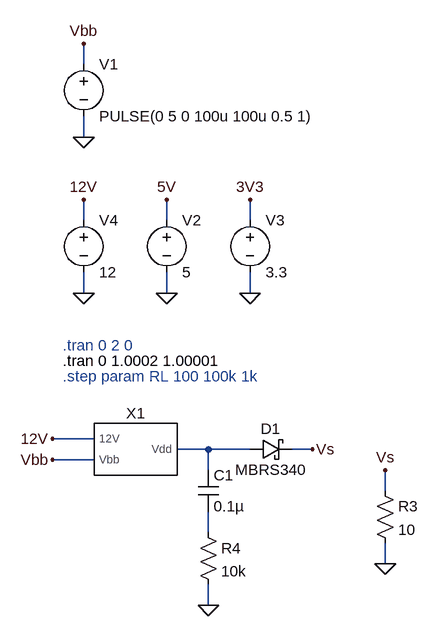
[diagram p0: schematic PDM-test-0.asc]
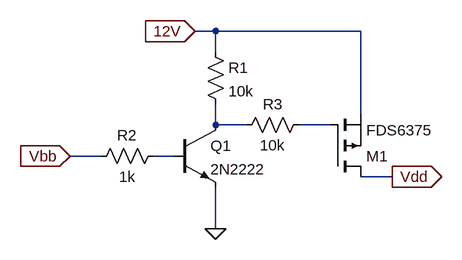
[diagram p1: sub-circuit pmos_5vl_12vp_hss.asc]
PDM-test-0.asc, the LTspice schematic file:
Version 4
SHEET 1 1652 1172
WIRE -48 96 -48 64
WIRE -48 208 -48 176
WIRE -48 336 -48 304
WIRE 80 336 80 304
WIRE 208 336 208 304
WIRE -48 448 -48 416
WIRE 80 448 80 416
WIRE 208 448 208 416
WIRE -32 672 -96 672
WIRE 144 688 96 688
WIRE 208 688 144 688
WIRE 304 688 272 688
WIRE -32 704 -96 704
WIRE 144 720 144 688
WIRE 416 752 416 720
WIRE 144 816 144 784
WIRE 416 864 416 832
WIRE 144 928 144 896
FLAG -48 208 0
FLAG -48 64 Vbb
FLAG 80 448 0
FLAG 80 304 5V
FLAG 208 448 0
FLAG 208 304 3V3
FLAG -48 448 0
FLAG -48 304 12V
FLAG 416 864 0
FLAG 144 928 0
FLAG -96 672 12V
FLAG -96 704 Vbb
FLAG 304 688 Vs
FLAG 416 720 Vs
SYMBOL voltage -48 80 R0
WINDOW 123 0 0 Left 0
WINDOW 39 0 0 Left 0
SYMATTR InstName V1
SYMATTR Value PULSE(0 5 0 100u 100u 0.5 1)
SYMBOL voltage 80 320 R0
WINDOW 123 0 0 Left 0
WINDOW 39 0 0 Left 0
SYMATTR InstName V2
SYMATTR Value 5
SYMBOL voltage 208 320 R0
WINDOW 123 0 0 Left 0
WINDOW 39 0 0 Left 0
SYMATTR InstName V3
SYMATTR Value 3.3
SYMBOL voltage -48 320 R0
WINDOW 123 0 0 Left 0
WINDOW 39 0 0 Left 0
SYMATTR InstName V4
SYMATTR Value 12
SYMBOL res 400 736 R0
SYMATTR InstName R3
SYMATTR Value 10
SYMBOL cap 128 720 R0
SYMATTR InstName C1
SYMATTR Value 0.1µ
SYMBOL PMOS_5VL_12VP_HSS 32 688 R0
SYMATTR InstName X1
SYMBOL schottky 208 704 R270
WINDOW 0 32 32 VTop 2
WINDOW 3 0 32 VBottom 2
SYMATTR InstName D1
SYMATTR Value MBRS340
SYMATTR Description Diode
SYMATTR Type diode
SYMBOL res 128 800 R0
SYMATTR InstName R4
SYMATTR Value 10k
TEXT -80 552 Left 2 !.tran 0 1.0002 1.00001
TEXT -80 576 Left 2 ;.step param RL 100 100k 1k
TEXT -80 528 Left 2 ;.tran 0 2 0

pmos_5vl_12vp_hss.asc, the sub-circuit schematic file:
Version 4
SHEET 1 1336 680
WIRE 960 -64 928 -64
WIRE 1184 -64 960 -64
WIRE 960 -32 960 -64
WIRE 1184 64 1184 -64
WIRE 960 80 960 48
WIRE 1008 80 960 80
WIRE 1136 80 1088 80
WIRE 784 128 736 128
WIRE 896 128 864 128
WIRE 1232 160 1184 160
WIRE 960 240 960 176
FLAG 960 240 0
FLAG 736 128 Vbb
IOPIN 736 128 In
FLAG 928 -64 12V
IOPIN 928 -64 In
FLAG 1232 160 Vdd
IOPIN 1232 160 Out
SYMBOL npn 896 80 R0
SYMATTR InstName Q1
SYMATTR Value 2N2222
SYMBOL res 944 -48 R0
SYMATTR InstName R1
SYMATTR Value 10k
SYMBOL res 880 112 R90
WINDOW 0 0 56 VBottom 2
WINDOW 3 32 56 VTop 2
SYMATTR InstName R2
SYMATTR Value 1k
SYMBOL pmos 1136 160 M180
SYMATTR InstName M1
SYMATTR Value FDS6375
SYMBOL res 1104 64 R90
WINDOW 0 0 56 VBottom 2
WINDOW 3 32 56 VTop 2
SYMATTR InstName R3
SYMATTR Value 10k

The netlist it stands for:
* PDM-test-0.asc
V1 Vbb 0 PULSE(0 5 0 100u 100u 0.5 1)
V2 5V 0 5
V3 3V3 0 3.3
V4 12V 0 12
R3 Vs 0 10
C1 N001 N002 0.1µ
XX1 12V Vbb N001 pmos_5vl_12vp_hss
D1 N001 Vs MBRS340
R4 N002 0 10k

* block symbol definitions
.subckt pmos_5vl_12vp_hss 12V Vbb Vdd
Q1 N001 N003 0 0 2N2222
R1 12V N001 10k
R2 N003 Vbb 1k
M1 Vdd N002 12V 12V FDS6375
R3 N002 N001 10k
.ends pmos_5vl_12vp_hss

.model D D
.lib standard.dio
.model NPN NPN
.model PNP PNP
.lib standard.bjt
.model NMOS NMOS
.model PMOS PMOS
.lib standard.mos
.tran 0 1.0002 1.00001
* .step param RL 100 100k 1k
* .tran 0 2 0
.backanno
.end